# Altium schematic sheet CSMSF.SchDoc
size A4; SheetNumber: 2; SheetTotal: 3
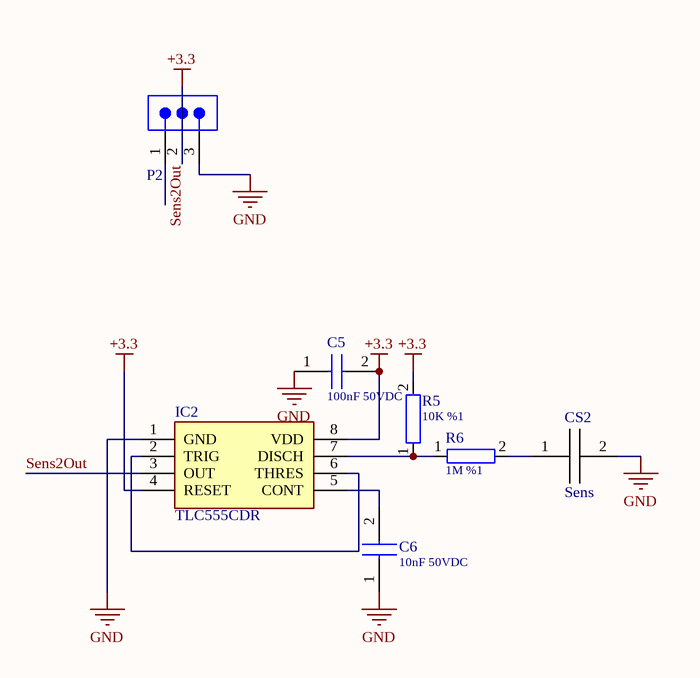
[diagram p0: CSMSF.SchDoc]

## Parts
C5  value 100nF 50VDC  [0603 CAP]  (hidden comment: CL10B104KB8NNNC)
C6  value 10nF 50VDC  [0603 CAP]  (hidden comment: CC0603KRX7R9BB103)
CS2  Sens  [Sens]
IC2  TLC555CDR  [SOIC127P600X175-8N]
P2  61300311021  [61300311021]  (value not drawn)
R5  value 10K %1  [0603 RES]  (hidden comment: 0603SAF1002T5E)
R6  value 1M %1  [0603 RES]  (hidden comment: 0603SAF1004T5E)

## Nets
+3.3: C5.2 IC2.4(RESET) IC2.8(VDD) P2.2 R5.2
GND: C5.1 C6.1 CS2.2 IC2.1(GND) P2.3
Sens2Out: IC2.3(OUT) P2.1
NetC6_2: C6.2 IC2.5(CONT)
NetCS2_1: CS2.1 R6.2
NetIC2_2: IC2.2(TRIG) IC2.6(THRES)
NetIC2_7: IC2.7(DISCH) R5.1 R6.1

## Library data of the parts
C5 = CL10B104KB8NNNC: 100nF 50VDC ±10% X7R MLCC 0603; Ozdisan Price/Stock: https://ozdisan.com/Product/Detail/522144/CL10A106MO8NQNC; Supplier 1: Arrow Electronics; Supplier Part Number 1: CL10B104KB8NNNC
C6 = CC0603KRX7R9BB103: 10nF, 50 V, ± 10%, X7R, 0603, Multilayer Ceramic Capacitor,; Ozdisan Price/Stock: https://ozdisan.com/Product/Detail/522144/CL10A106MO8NQNC; Supplier 1: Digi-Key; Supplier Part Number 1: 311-1085-1-ND
CS2 = Sens: Pcb Sens
IC2 = TLC555CDR: 555 Astable 2.1-MHz, 250-µA, Low-Power Timer 8-SOIC 0 to 70; Manufacturer_Name: Texas Instruments; Datasheet Link: https://www.ti.com/lit/ds/symlink/tlc555.pdf?ts=1599218356509&ref_url=https%253A%252F%252Fwww.ti.com%252Fstore%252Fti%252Fen%252Fp%252Fproduct%252F%253Fp%253DTLC555CDR%2526keyMatch%253DTLC555CDR%2526tisearch%253DSearch-EN-everything%2526usecase%253DOPN; Height: 1.75mm; Manufacturer_Part_Number: TLC555CDR; Mouser Part Number: 595-TLC555CDR; Mouser Price/Stock: https://www.mouser.co.uk/ProductDetail/Texas-Instruments/TLC555CDR?qs=gb35HGp1gQImgWgRW%252BGYaw%3D%3D; Arrow Part Number: TLC555CDR; Arrow Price/Stock: https://www.arrow.com/en/products/tlc555cdr/texas-instruments?region=nac; Supplier 1: Mouser; Supplier Part Number 1: 595-TLC555CDR
P2 = 61300311021: WR-PHD Pin Header, THT, Angled, pitch 2.54mm, 1 Row, 3P; Manufacturer: Wurth Elektronik; Contact Resistance: 20mΩ; Rated Current: 3A; Working Voltage: 250V; Withstanding Voltage: 500V; ComponentLink1Description: Website Link; ComponentLink1URL: https://www.we-online.com/redexpert/article/61300311021?ad; ComponentLink2Description: Datasheet Link; ComponentLink2URL: https://www.we-online.com/redexpert/spec/61300311021?ad; Manufacturer Part Number: 61300311021; Category: Board-to-Board Connectors; Match Code: WR-PHD; Mount: Through Hole; Operating Temperature Max: 105°C; Operating Temperature Min: -40°C; Packaging: Bag; Gender: Pin Header; Number of Pins: 3; Number of Rows: 1; Orientation: Angled; Pitch: 2.54mm; Supplier 1: Digi-Key; Supplier Part Number 1: 732-5336-ND
R5 = 0603SAF1002T5E: 10K Ohms 1% 1/10W-S 100PPM RES 0603; Ozdisan Price/Stock: https://ozdisan.com/Product/Detail/522144/CL10A106MO8NQNC; Supplier 1: Farnell; Supplier Part Number 1: 1632392
R6 = 0603SAF1004T5E: 1M Ohms 1% 1/10W-S 100PPM RES 0603; Ozdisan Price/Stock: https://ozdisan.com/Product/Detail/522144/CL10A106MO8NQNC; Supplier 1: Newark; Supplier Part Number 1: 79M5904